# Altium schematic sheet Schematic.SchDoc
size A4; SheetNumber: 1; SheetTotal: 1
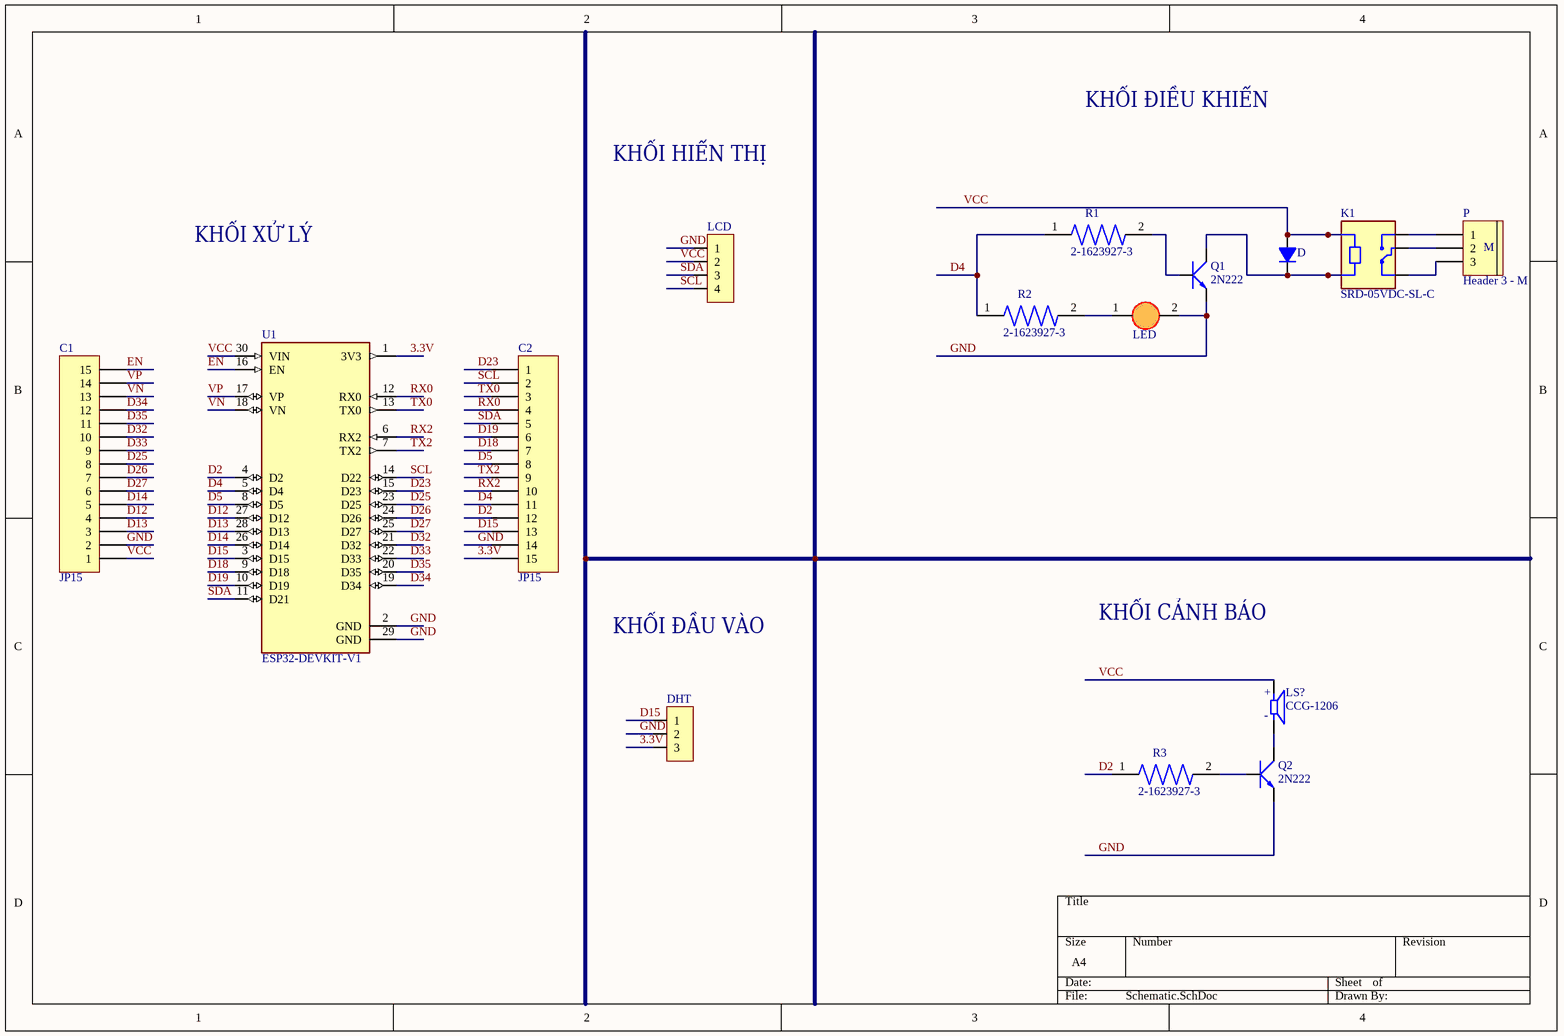
[diagram p0: Schematic.SchDoc]

## Parts
C1  JP15  [JP15-C1T]
C2  JP15  [JP15-C1T]
D  (no value)  [DIODE 1A]
DHT  DHT  [JP 1x3 CT]  (value not drawn)
K1  SRD-05VDC-SL-C  [RELAY_SRD-05VDC-SL-C]
LCD  JP 1x4 2.54  [JP 1x4 CT]  (value not drawn)
LED  LED5  [LED-5 GRe]  (value not drawn)
LS?  CCG-1206  [CUI_CCG-1206]
P  Header 3 - M  [Medium - Header 3]
Q1  2N222  [TO92-123]
Q2  2N222  [TO92-123]
R1  2-1623927-3  [RESAD700W45L350D185]
R2  2-1623927-3  [RESAD700W45L350D185]
R3  2-1623927-3  [RESAD700W45L350D185]
U1  ESP32-DEVKIT-V1  [MODULE_ESP32_DEVKIT_V1]

## Nets
3.3V: C2.15 DHT.3 U1.1(3V3)
D2: C2.12 R3.1 U1.4(D2)
D4: C2.11 R1.1 R2.1 U1.5(D4)
D5: C2.8 U1.8(D5)
D12: C1.4 U1.27(D12)
D13: C1.3 U1.28(D13)
D14: C1.5 U1.26(D14)
D15: C2.13 DHT.1 U1.3(D15)
D18: C2.7 U1.9(D18)
D19: C2.6 U1.10(D19)
D23: C2.1 U1.15(D23)
D25: C1.8 U1.23(D25)
D26: C1.7 U1.24(D26)
D27: C1.6 U1.25(D27)
D32: C1.10 U1.21(D32)
D33: C1.9 U1.22(D33)
D34: C1.12 U1.19(D34)
D35: C1.11 U1.20(D35)
EN: C1.15 U1.16(EN)
GND: C1.2 C2.14 DHT.2 LCD.1 LED.2(K) Q1.1(E) Q2.1(E) U1.2(GND) U1.29(GND)
RX0: C2.4 U1.12(RX0)
RX2: C2.10 U1.6(RX2)
SCL: C2.2 LCD.4 U1.14(D22)
SDA: C2.5 LCD.3 U1.11(D21)
TX0: C2.3 U1.13(TX0)
TX2: C2.9 U1.7(TX2)
VCC: C1.1 D.1(A) K1.A1 LCD.2 LS?.P U1.30(VIN)
VN: C1.13 U1.18(VN)
VP: C1.14 U1.17(VP)
NetD_2: D.2(K) K1.A2 Q1.3(C)
NetK1_COM: K1.COM P.2
NetK1_NC: K1.NC P.3
NetK1_NO: K1.NO P.1
NetLED_1: LED.1(A) R2.2
NetLS?_M: LS?.M Q2.3(C)
NetQ1_2: Q1.2(B) R1.2
NetQ2_2: Q2.2(B) R3.2

## Notes on the sheet
- KHỐI ĐIỀU KHIỂN
- KHỐI HIỂN THỊ
- KHỐI XỬ LÝ
- KHỐI ĐẦU VÀO
- KHỐI CẢNH BÁO
- (in symbol CCG-1206) +; -
- (in symbol Header 3 - M) M

## Library data of the parts
C1 C2 = JP15: WR-PHD 2.54 mm Angled Socket Header; Manufacturer: W¨¹rth Elektronik eiSos GmbH; partNo: 613015143121; ComponentLink1 Description: Manufacturer; ComponentLink2 Description: Datasheet; NoPins: 15; Created Date: 29 March 2013; ComponentLink1URL: http://www.we-online.com; ComponentLink2URL: http://katalog.we-online.de/em/datasheet/6130xx143121.pdf; Created by: Karrer Zheng
D = Diode 1N4007: Cắm; Ten_Linh_Kien: Diode 1N4007 1A (DIP); Don_Vi: Con; Ma_Hang: MH001063; Ghi Chu: *; Kieu_Chan: *; Chung_Loai: Cắm
DHT = JP 1x3 2.54 Cai Thang: Cắm; Ten_Linh_Kien: Jump Đơn Cái 2.54MM 1x20P Thẳng; Don_Vi: Con; Ma_Hang: MH004006; Ghi_Chu: *; Kieu_Chan: *; Chung_Loai: Cắm
K1 = SRD-05VDC-SL-C: 5V Trigger Relay Module For Arduino And Raspberry Pi 5V Trigger Relay Module For Arduino And Raspberry Pi; MF: Songle Relay; Price: None; Availability: Not in stock; MP: SRD-05VDC-SL-C; Package: NON STANDARD-5 Songle Relay; SnapEDA_Link: https://www.snapeda.com/parts/SRD-05VDC-SL-C/Songle+Relay/view-part/?ref=snap; Check_prices: https://www.snapeda.com/parts/SRD-05VDC-SL-C/Songle+Relay/view-part/?ref=eda; Value: *
LCD = JP 1x4 2.54 Cai Thang: Cắm; Ten_Linh_Kien: Jump Đơn Cái 2.54MM 1x20P Thẳng; Don_Vi: Con; Ma_Hang: MH004006; Ghi_Chu: *; Kieu_Chan: *; Chung_Loai: Cắm
LED = LED 5mm
LS? = CCG-1206: 12 mm, 5 V, 85 dB, Through Hole, Sealed, Magnetic Audio Transducer Buzzer; Availability: Unavailable; Value: *; Package: None; MP: CCG-1206; Price: None
P = Header 3 - M: Header, 3-Pin, Medium; LatestRevisionDate: 17-Jul-2002; LatestRevisionNote: Re-released for DXP Platform.; Publisher: Altium Limited
Q1 Q2 = 2N222: NPN 600mW, ECB; Value: C1815
R1-R3 = 2-1623927-3: Carbon Film Resistors - Through Hole 1K Ohm 5% 1/4W Res Carbon Film; Voltage_Rating: 200 V; MF: TE Connectivity; Power_Rating: .25 W; Value: *; Tolerance: 5%; SnapEDA_Link: https://www.snapeda.com/parts/2-1623927-3/TE+Connectivity/view-part/?ref=snap; Resistance: 1K; Purchase-URL: https://pricing.snapeda.com/search/part/2-1623927-3/?ref=eda; EU_RoHS_Compliance: Compliant; Availability: In Stock; Price: None; Package: None; Check_prices: https://www.snapeda.com/parts/2-1623927-3/TE+Connectivity/view-part/?ref=eda; MP: 2-1623927-3
U1 = ESP32-DEVKIT-V1: Dual core, Wi-Fi: 2.4 GHz up to 150 Mbits/s,BLE (Bluetooth Low Energy) and legacy Bluetooth, 32 bits, Up to 240 MHz; MF: Do it; Price: None; Availability: Not in stock; Package: None; MP: ESP32-DEVKIT-V1; Value: *; SnapEDA_Link: https://www.snapeda.com/parts/ESP32-DEVKIT-V1/Do+it/view-part/?ref=snap; Check_prices: https://www.snapeda.com/parts/ESP32-DEVKIT-V1/Do+it/view-part/?ref=eda